# EAGLE schematic Arduino Board (EAGLE 8.4.3)
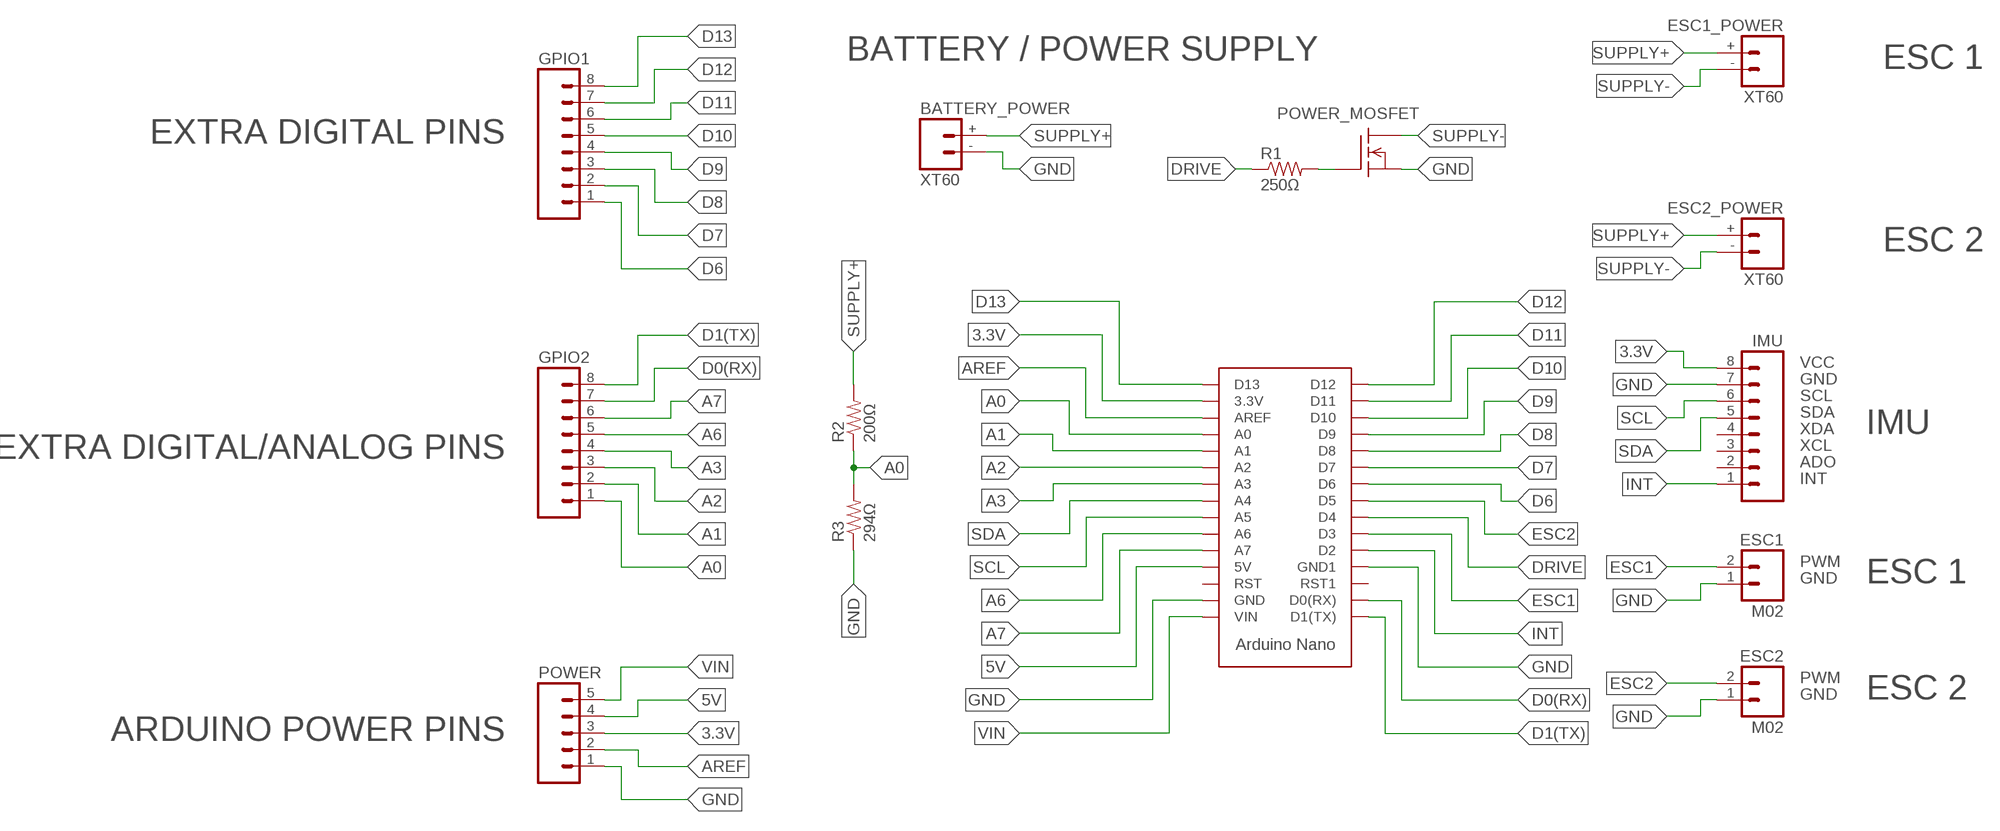
[diagram p0: schematic, sheet 1]

## Parts
BATTERY_POWER  XT60  [XT60]
ESC1  M02  [1X02]
ESC1_POWER  XT60  [XT60]
ESC2  M02  [1X02]
ESC2_POWER  XT60  [XT60]
GPIO1  M08  [1X08]
GPIO2  M08  [1X08]
IMU  M08  [1X08]
POWER  M05  [1X05]
POWER_MOSFET  N-CHANNEL_MOSFETGENERIC  [TO-220-SINK]
R1  250Ω  RESISTORPTH-1/4W  [AXIAL-0.4]
R2  200Ω  RESISTORPTH-1/4W  [AXIAL-0.4]
R3  294Ω  RESISTORPTH-1/4W  [AXIAL-0.4]
U$1  ARDUINO_NANO  [ARDUINO_NANO]

## Nets
3.3V: IMU.8 POWER.3 U$1.3.3V
5V: POWER.4 U$1.5V
A0: GPIO2.1 R2.P$1 R3.P$2 U$1.A0
A1: GPIO2.2 U$1.A1
A2: GPIO2.3 U$1.A2
A3: GPIO2.4 U$1.A3
A6: GPIO2.5 U$1.A6
A7: GPIO2.6 U$1.A7
AREF: POWER.2 U$1.AREF
D0(RX): GPIO2.7 U$1.D0(RX)
D1(TX): GPIO2.8 U$1.D1(TX)
D6: GPIO1.1 U$1.D6
D7: GPIO1.2 U$1.D7
D8: GPIO1.3 U$1.D8
D9: GPIO1.4 U$1.D9
D10: GPIO1.5 U$1.D10
D11: GPIO1.6 U$1.D11
D12: GPIO1.7 U$1.D12
D13: GPIO1.8 U$1.D13
DRIVE: R1.P$1 U$1.D4
ESC1: ESC1.2 U$1.D3
ESC2: ESC2.2 U$1.D5
GND: BATTERY_POWER.- ESC1.1 ESC2.1 IMU.7 POWER.1 POWER_MOSFET.3(S) R3.P$1 U$1.GND U$1.GND1
INT: IMU.1 U$1.D2
N$1: POWER_MOSFET.1(G) R1.P$2
SCL: IMU.6 U$1.A5
SDA: IMU.5 U$1.A4
SUPPLY+: BATTERY_POWER.+ ESC1_POWER.+ ESC2_POWER.+ R2.P$2
SUPPLY-: ESC1_POWER.- ESC2_POWER.- POWER_MOSFET.2(D)
VIN: POWER.5 U$1.VIN
Unconnected: IMU.2 IMU.3 IMU.4 U$1.RST U$1.RST1

## Notes on the sheet
- BATTERY / POWER SUPPLY
- ESC 1
- EXTRA DIGITAL PINS
- ESC 2
- VCC
- GND
- SCL
- SDA
- EXTRA DIGITAL/ANALOG PINS | XDA | IMU
- XCL
- ADO
- INT
- PWM
- GND | ESC 1
- PWM
- GND | ESC 2
- ARDUINO POWER PINS

## Library data of the parts
BATTERY_POWER ESC1_POWER ESC2_POWER = Controls Library:XT60
ESC1 ESC2 = Controls Library:M02: Standard 2-pin 0.1" header. NOTES ON THE VARIANTS LOCK and LOCK_LONGPADS... This footprint was designed to help hold the alignment of a through-hole component (i.e. 6-pin header) while soldering it into place. You may notice that each hole has been shifted either up or down by 0.005 of an inch from it's more standard position (which is a perfectly straight line). This slight alteration caused the pins (the squares in the middle) to touch the edges of the holes. Because they are alternating, it causes a "brace" to hold the component in place. 0.005 has proven to be the perfect amount of "off-center" position when using our standard breakaway headers. Although looks a little odd when you look at the bare footprint, once you have a header in there, the alteration is very hard to notice. Also,if you push a header all the way into place, it is covered up entirely on the bottom side. This idea of altering the position of holes to aid alignment will be further integrated into the Sparkfun Library for other footprints. It can help hold any component with 3 or more connection pins. Note: The Sparkfun version includes many other packages including surface mount that may be of future interest. Source: Sparkfun <https://github.com/sparkfun/SparkFun-Eagle-Libraries>
GPIO1 GPIO2 IMU = Controls Library:M08: Standard 8-pin 0.1" header. NOTES ON THE VARIANTS LOCK and LOCK_LONGPADS... This footprint was designed to help hold the alignment of a through-hole component (i.e. 6-pin header) while soldering it into place. You may notice that each hole has been shifted either up or down by 0.005 of an inch from it's more standard position (which is a perfectly straight line). This slight alteration caused the pins (the squares in the middle) to touch the edges of the holes. Because they are alternating, it causes a "brace" to hold the component in place. 0.005 has proven to be the perfect amount of "off-center" position when using our standard breakaway headers. Although looks a little odd when you look at the bare footprint, once you have a header in there, the alteration is very hard to notice. Also,if you push a header all the way into place, it is covered up entirely on the bottom side. This idea of altering the position of holes to aid alignment will be further integrated into the Sparkfun Library for other footprints. It can help hold any component with 3 or more connection pins. Note: The Sparkfun version includes many other packages including surface mount that may be of future interest. Source: Sparkfun <https://github.com/sparkfun/SparkFun-Eagle-Libraries>
POWER = Controls Library:M05: Standard 5-pin 0.1" header. NOTES ON THE VARIANTS LOCK and LOCK_LONGPADS... This footprint was designed to help hold the alignment of a through-hole component (i.e. 5-pin header) while soldering it into place. You may notice that each hole has been shifted either up or down by 0.005 of an inch from it's more standard position (which is a perfectly straight line). This slight alteration caused the pins (the squares in the middle) to touch the edges of the holes. Because they are alternating, it causes a "brace" to hold the component in place. 0.005 has proven to be the perfect amount of "off-center" position when using our standard breakaway headers. Although looks a little odd when you look at the bare footprint, once you have a header in there, the alteration is very hard to notice. Also,if you push a header all the way into place, it is covered up entirely on the bottom side. This idea of altering the position of holes to aid alignment will be further integrated into the Sparkfun Library for other footprints. It can help hold any component with 3 or more connection pins. Note: The Sparkfun version includes many other packages including surface mount that may be of future interest. Source: Sparkfun <https://github.com/sparkfun/SparkFun-Eagle-Libraries>
POWER_MOSFET = Controls Library:N-CHANNEL_MOSFET: Generic N-Channel MOSFET; _EXTERNAL_: 1
R1-R3 = Controls Library:RESISTOR: Resistor Basic schematic elements and footprints for 0603, 1206, and PTH resistors.
U$1 = Controls Library:ARDUINO_NANO: Arduino Nano Device Specifications <https://www.arduino.cc/en/Main/ArduinoBoardNano> Pinout Diagram <http://pighixxx.com/nanopdf.pdf>